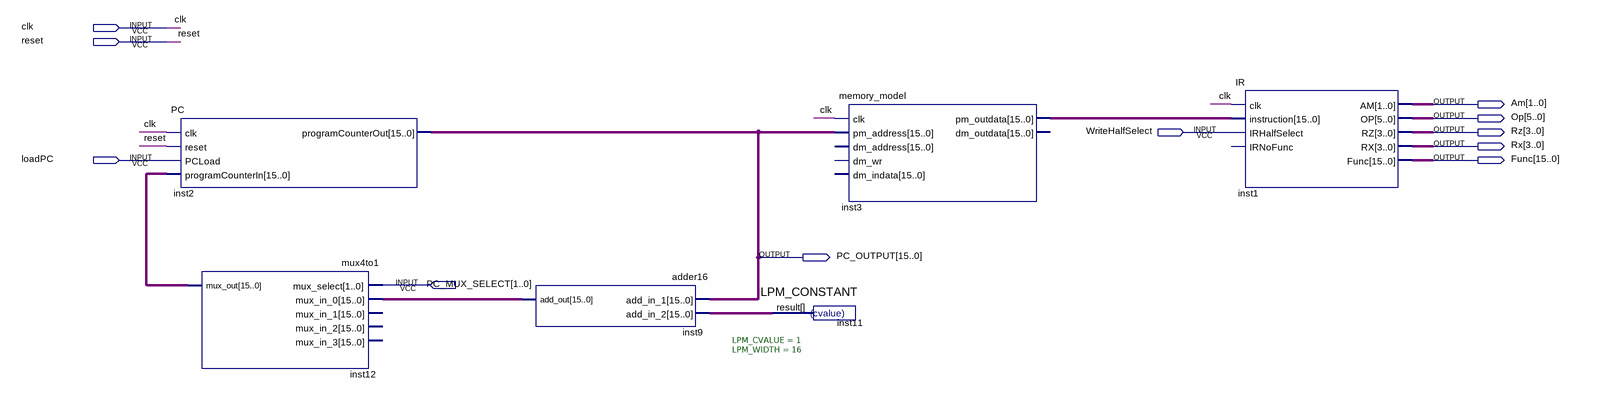
[diagram p0: schematic sheet]
// Quartus schematic PC_MEMORY_testbench.bdf as structural Verilog: 6 symbols, 11 pins
module PC_MEMORY_testbench (
  input  clk,
  input  reset,
  input  WriteHalfSelect,
  input  loadPC,
  input  [1:0] PC_MUX_SELECT,
  output [1:0] Am,
  output [5:0] Op,
  output [3:0] Rz,
  output [3:0] Rx,
  output [15:0] Func,
  output [15:0] PC_OUTPUT
);

  wire [15:0] inst3_pm_outdata, inst9_add_out, inst11_result, inst12_mux_out;

  PC inst2 (
    .clk(clk), .reset(reset), .PCLoad(loadPC), .programCounterIn(inst12_mux_out),
    .programCounterOut(PC_OUTPUT));
  mux4to1 inst12 (
    .mux_select(PC_MUX_SELECT), .mux_in_0(inst9_add_out), .mux_out(inst12_mux_out));  // open: mux_in_1, mux_in_2, mux_in_3
  adder16 inst9 (.add_in_1(PC_OUTPUT), .add_in_2(inst11_result), .add_out(inst9_add_out));
  LPM_CONSTANT #(.LPM_CVALUE(1), .LPM_WIDTH(16)) inst11 (.result(inst11_result));
  memory_model inst3 (
    .clk(clk), .pm_address(PC_OUTPUT), .pm_outdata(inst3_pm_outdata));  // open: dm_address, dm_wr, dm_indata, dm_outdata
  IR inst1 (
    .clk(clk), .instruction(inst3_pm_outdata), .IRHalfSelect(WriteHalfSelect), .AM(Am), .OP(Op), .RZ(Rz),
    .RX(Rx), .Func(Func));  // open: IRNoFunc
endmodule
